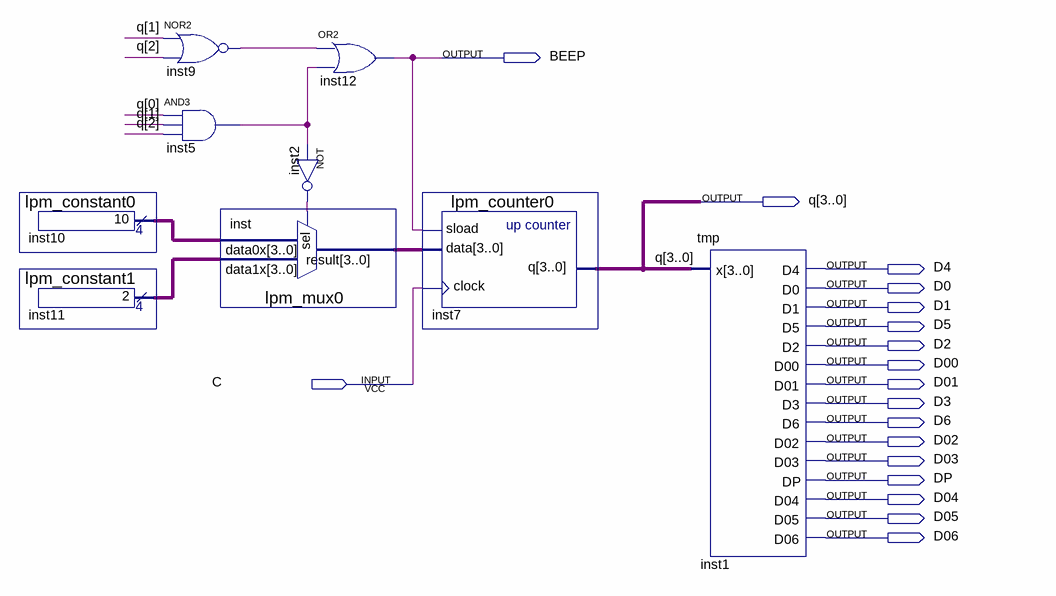
[diagram p0: schematic sheet]
// Quartus schematic Lab7_2.bdf as structural Verilog: 9 symbols, 18 pins
module Lab7_2 (
  input  C,
  output BEEP,
  output [3:0] q,
  output D4,
  output D0,
  output D1,
  output D5,
  output D2,
  output D00,
  output D01,
  output D3,
  output D6,
  output D02,
  output D03,
  output DP,
  output D04,
  output D05,
  output D06
);

  wire inst2_out, inst5_out, inst9_out;
  wire [3:0] inst10_result, inst11_result, inst_result;

  lpm_constant0 inst10 (.result(inst10_result));
  lpm_constant1 inst11 (.result(inst11_result));
  nor inst9 (inst9_out, q[1], q[2]);
  and inst5 (inst5_out, q[0], q[1], q[2]);
  lpm_mux0 inst (.data1x(inst11_result), .data0x(inst10_result), .sel(inst2_out), .result(inst_result));
  or inst12 (BEEP, inst9_out, inst5_out);
  not inst2 (inst2_out, inst5_out);
  lpm_counter0 inst7 (.sload(BEEP), .data(inst_result), .clock(C), .q(q));
  tmp inst1 (
    .x(q), .D4(D4), .D0(D0), .D1(D1), .D5(D5), .D2(D2), .D00(D00), .D01(D01), .D3(D3), .D6(D6), .D02(D02),
    .D03(D03), .DP(DP), .D04(D04), .D05(D05), .D06(D06));
endmodule
